# EAGLE schematic board_power (EAGLE 7.5.0)
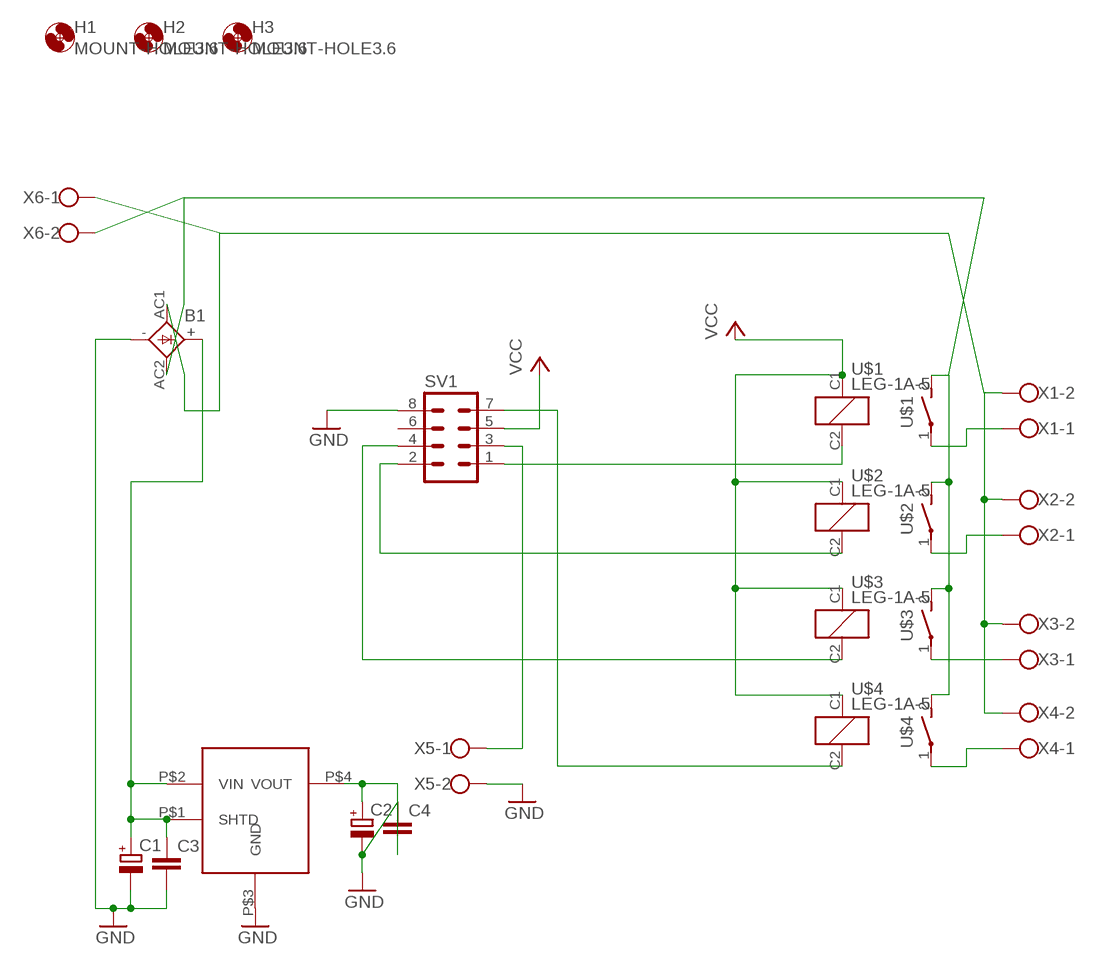
[diagram p0: schematic, sheet 1]

## Parts
B1  KBK10A  [KBK10A]
C1  CPOL-EUE5-4  [E5-4]
C2  CPOL-EUE5-4  [E5-4]
C3  C-EU025_050-025X075  [C025_050-025X075]
C4  C-EU025_050-025X075  [C025_050-025X075]
H1  MOUNT-HOLE3.6  [3,6]
H2  MOUNT-HOLE3.6  [3,6]
H3  MOUNT-HOLE3.6  [3,6]
SV1  MA04-2  [MA04-2]
U$1  LEG-1A-5  [LEG]
U$2  LEG-1A-5  [LEG]
U$3  LEG-1A-5  [LEG]
U$4  LEG-1A-5  [LEG]
U$5  POLOLU-2098  [POLOLU-2098]
X1  PASSO3  [PASSO3]
X2  PASSO3  [PASSO3]
X3  PASSO3  [PASSO3]
X4  PASSO3  [PASSO3]
X5  PASSO3  [PASSO3]
X6  PASSO3  [PASSO3]

## Nets
GND: B1.- C1.- C2.- C3.2 C4.1 SV1.8 U$5.P$3(GND) X5.2
N$1: SV1.1 U$1.C2
N$2: SV1.2 U$2.C2
N$3: SV1.4 U$3.C2
N$4: SV1.7 U$4.C2
N$5: SV1.3 X5.1
N$6: B1.AC2 U$1.2(S) U$2.2(S) U$3.2(S) U$4.2(S) X6.2
N$7: B1.AC1 X1.2 X2.2 X3.2 X4.2 X6.1
N$8: U$1.1(P) X1.1
N$9: U$2.1(P) X2.1
N$10: U$3.1(P) X3.1
N$11: U$4.1(P) X4.1
N$12: B1.+ C1.+ C3.1 U$5.P$1(SHTD) U$5.P$2(VIN)
N$13: C2.+ C4.2 U$5.P$4(VOUT)
VCC: SV1.5 U$1.C1 U$2.C1 U$3.C1 U$4.C1
Unconnected: SV1.6

## Library data of the parts
B1 = rectifier_mod:KBK10A: RECTIFIER 3.2 A
C1 C2 = resistor:CPOL-EU: POLARIZED CAPACITOR, European symbol
C3 C4 = resistor:C-EU: CAPACITOR, European symbol
H1-H3 = holes:MOUNT-HOLE: MOUNTING HOLE with drill center marker
SV1 = con-lstb:MA04-2: PIN HEADER; OC_FARNELL: unknown; OC_NEWARK: unknown
U$1-U$4 = relay-mod:LEG-1A-5
U$5 = eagle:POLOLU-2098
X1-X6 = con-wago-500:PASSO3: WAGO SCREW CLAMP; MPN: 237-102; OC_FARNELL: unknown; OC_NEWARK: 70K9898